# EAGLE design LTC3109 (EAGLE 7.1.0)
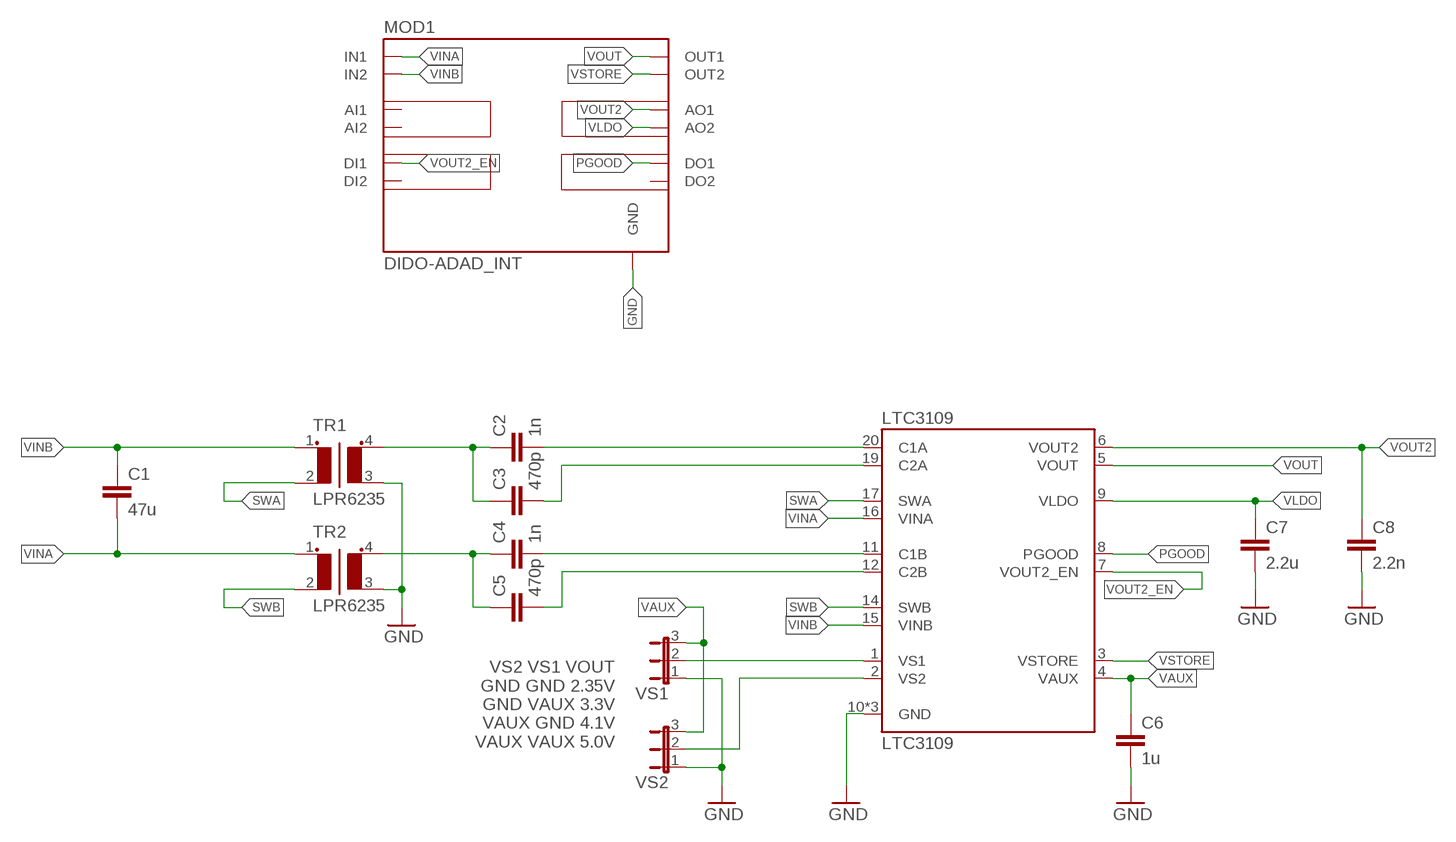
[diagram p0: schematic, sheet 1]

## Parts
C1  47u  C-EUC0805  [C0805]
C2  1n  C-EUC0805  [C0805]
C3  470p  C-EUC0805  [C0805]
C4  1n  C-EUC0805  [C0805]
C5  470p  C-EUC0805  [C0805]
C6  1u  C-EUC0805  [C0805]
C7  2.2u  C-EUC0805  [C0805]
C8  2.2n  C-EUC0805  [C0805]
LTC3109  LTC3109  [SSOP20_NARROW]
MOD1  DIDO-ADAD_INT  [DIDO-ADAD]
TR1  LPR6235  [LPR6235]
TR2  LPR6235  [LPR6235]
VS1  JP2E  [JP2]
VS2  JP2E  [JP2]

## Nets
GND: C6.2 C7.2 C8.2 LTC3109.10(GND) LTC3109.13(GND) LTC3109.18(GND) MOD1.GND1(GND) MOD1.GND2(GND) MOD1.GND3(GND) MOD1.GND4(GND) TR1.3(S2) TR2.3(S2) VS1.1 VS2.1
N$2: C2.2 LTC3109.20(C1A)
N$3: C3.2 LTC3109.19(C2A)
N$5: C2.1 C3.1 TR1.4(S1)
N$6: C4.2 LTC3109.11(C1B)
N$7: C5.2 LTC3109.12(C2B)
N$8: LTC3109.1(VS1) VS1.2
N$9: C4.1 C5.1 TR2.4(S1)
N$11: LTC3109.2(VS2) VS2.2
PGOOD: LTC3109.8(PGOOD) MOD1.DO1
SWA: LTC3109.17(SWA) TR1.2
SWB: LTC3109.14(SWB) TR2.2
VAUX: C6.1 LTC3109.4(VAUX) VS1.3 VS2.3
VINA: C1.2 LTC3109.16(VINA) MOD1.IN1_1(IN1) MOD1.IN1_2(IN1) MOD1.IN1_3(IN1) MOD1.IN1_4(IN1) TR2.1
VINB: C1.1 LTC3109.15(VINB) MOD1.IN2_1(IN2) MOD1.IN2_2(IN2) MOD1.IN2_3(IN2) MOD1.IN2_4(IN2) TR1.1
VLDO: C7.1 LTC3109.9(VLDO) MOD1.AO2
VOUT: LTC3109.5(VOUT) MOD1.OUT1_1(OUT1) MOD1.OUT1_2(OUT1) MOD1.OUT1_3(OUT1) MOD1.OUT1_4(OUT1)
VOUT2: C8.1 LTC3109.6(VOUT2) MOD1.AO1
VOUT2_EN: LTC3109.7(VOUT2_EN) MOD1.DI1
VSTORE: LTC3109.3(VSTORE) MOD1.OUT2_1(OUT2) MOD1.OUT2_2(OUT2) MOD1.OUT2_3(OUT2) MOD1.OUT2_4(OUT2)
Unconnected: MOD1.AI1 MOD1.AI2 MOD1.DI2 MOD1.DO2

## Notes on the sheet
- VS2 VS1 VOUT
  GND GND 2.35V
  GND VAUX 3.3V
  VAUX GND 4.1V
  VAUX VAUX 5.0V

## Library data of the parts
C1-C8 = rcl:C-EU: CAPACITOR, European symbol
LTC3109 = LTC3109:LTC3109
MOD1 = AllModules:DIDO-ADAD_INT
TR1 TR2 = LPR6235:LPR6235: TRANSFORMER for energy harvesting with a TEG and LTC3109 Source: Data sheet <http://datasheet.octopart.com/LPR6235-752SMLB-Coilcraft-datasheet-10791524.pdf> www.coilcraft.com
VS1 VS2 = Jumper_mod:JP2E: JUMPER

## Board
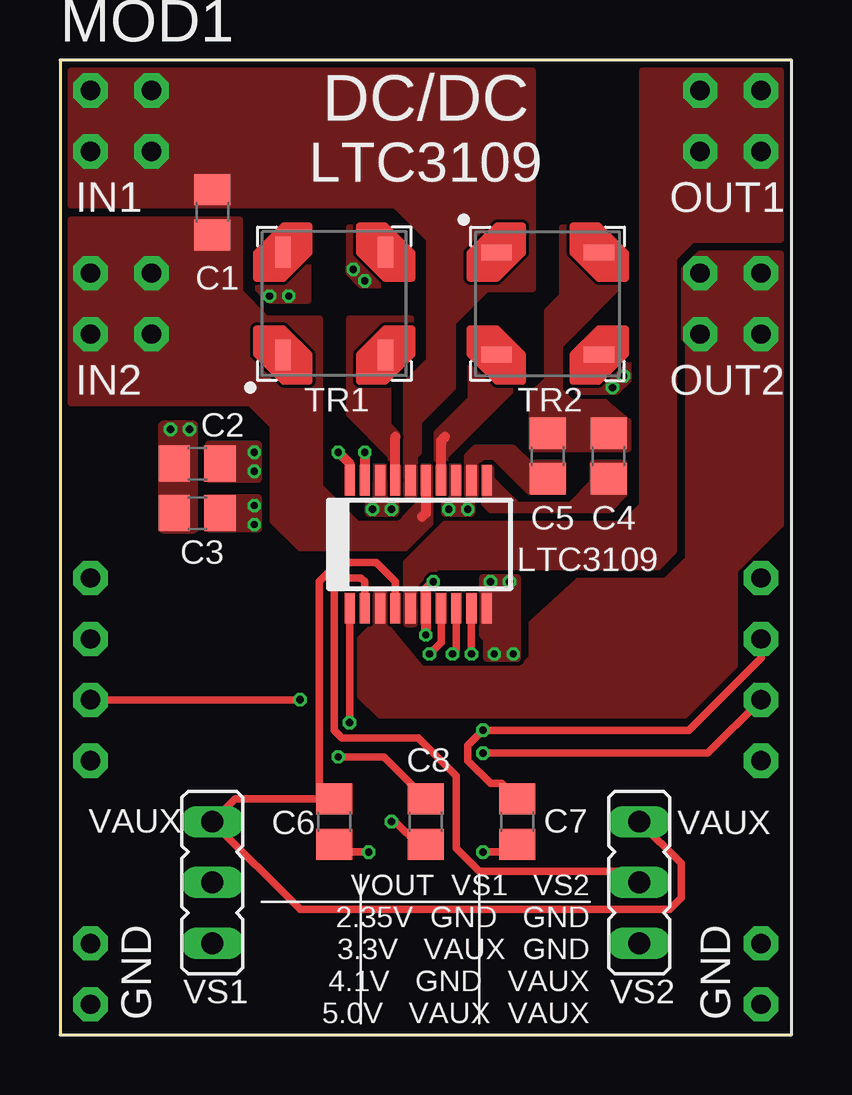
[diagram p1: board, top side]
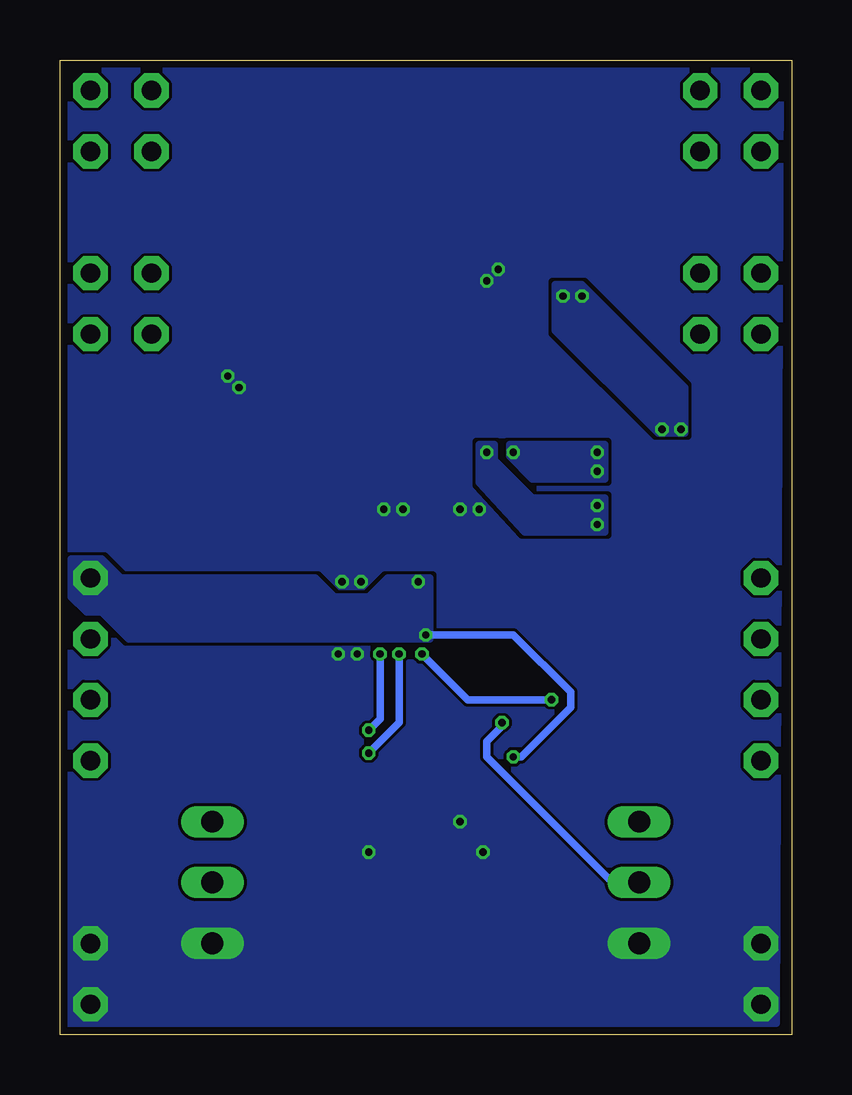
[diagram p2: board, bottom side, seen from below]

Size 30.48 x 40.64 mm. Coordinates in mm from the lower left corner, seen from the top.
Outline: 0,0 30.48,0 30.48,40.64 0,40.64 0,0
Copper layers (1*16): Top 0.035mm / dielectric 1.5mm / Bottom 0.035mm
Design rules "PCB-POOL HighSpec": minimum track width 0.125mm, minimum drill 0.2mm, track to track 0.125mm, track to pad 0.125mm, pad to pad 0.125mm, via to via 0.125mm, smd to smd 0.125mm, copper to edge 0.3mm, drill to drill 0.2mm, minimum pad ring 0.2mm, minimum via ring 0.125mm, stop-mask expansion 0.075mm, vias tented up to drill 0mil, thermal gap 0.2mm

### Footprints (pad centres in the part's own frame; a part is rotated, then mirrored left to right if it is on the bottom)
C0805 = smd 1.3 x 1.5: 1 -0.95,0; 2 0.95,0
SSOP20_NARROW = smd 0.419 x 1.27: 1 -3.175,-2.54; 2 -2.54,-2.54; 3 -1.905,-2.54; 4 -1.27,-2.54; 5 -0.635,-2.54; 6 0,-2.54; 7 0.635,-2.54; 8 1.27,-2.54; 9 1.905,-2.54; 10 2.54,-2.54; 11 2.54,2.794; 12 1.905,2.794; 13 1.27,2.794; 14 0.635,2.794; 15 0,2.794; 16 -0.635,2.794; 17 -1.27,2.794; 18 -1.905,2.794; 19 -2.54,2.794; 20 -3.175,2.794
DIDO-ADAD = drill 0.8 pad 1.422 octagon: AI1 0,-20.32; AI2 0,-22.86; AO1 27.94,-20.32; AO2 27.94,-22.86; DI1 0,-25.4; DI2 0,-27.94; DO1 27.94,-25.4; DO2 27.94,-27.94; GND1 0,-38.1; GND2 0,-35.56; GND3 27.94,-35.56; GND4 27.94,-38.1; IN1_1 0,0; IN1_2 0,-2.54; IN1_3 2.54,0; IN1_4 2.54,-2.54; IN2_1 0,-7.62; IN2_2 0,-10.16; IN2_3 2.54,-7.62; IN2_4 2.54,-10.16; OUT1_1 25.4,0; OUT1_2 25.4,-2.54; OUT1_3 27.94,0; OUT1_4 27.94,-2.54; OUT2_1 25.4,-7.62; OUT2_2 25.4,-10.16; OUT2_3 27.94,-7.62; OUT2_4 27.94,-10.16
LPR6235 = smd 1.27 x 0.635: 1 -2.13,2.135; 2 -2.13,-2.135; 3 2.13,-2.135; 4 2.13,2.135
JP2 = drill 0.914 long: 1 -2.54,0; 2 0,0; 3 2.54,0

### Placement (x,y rotation side)
C1  6.35,34.29 90 top
C2  5.71,23.81 0 top
C3  5.71,21.75 0 top
C4  22.86,24.13 270 top
C5  20.32,24.13 270 top
C6  11.43,8.89 270 top
C7  19.05,8.89 270 top
C8  15.24,8.89 270 top
LTC3109  15.24,20.32 0 top
MOD1  1.27,39.37 0 top
TR1  11.43,30.48 90 top
TR2  20.32,30.48 0 top
VS1  6.35,6.35 90 top
VS2  24.13,6.35 90 top

### Tracks (layer width: path | path; a pad name or v marks a point on that pad's centre or on a via)
GND  (via drill 0.3)
  Top 0.305: C6.2 11.75,7.62 v12.86,7.62 | v13.81,8.89 13.97,8.89 14.92,7.94 C8.2 | C7.2 18.73,7.62 v17.62,7.62
  other vias: 17.94,18.89 18.1,15.88 18.73,18.89 18.89,15.88 16.99,21.91 16.19,21.91 13.81,21.91 13.02,21.91 23.5,27.46 23.02,26.99 12.7,31.43 12.22,31.91
  pour Bottom (rank 2, no thermals): 0.48,40.16 0.64,0.48 30.16,0.48 30,40.16
  pour Top (no thermals): 17.62,19.05 17.62,16.67 17.78,16.51 17.78,15.72 19.05,15.72 19.05,19.05
  pour Top (rank 2, no thermals): 17.14,21.75 17.14,23.65 16.03,23.65 16.03,21.75
  pour Top (no thermals): 13.97,21.75 13.97,23.65 12.86,23.65 12.86,21.75
  pour Top (no thermals): 21.27,28.26 22.54,29.53 23.65,29.53 23.65,27.3 23.18,26.83 21.59,26.83 21.27,27.15
  pour Top (no thermals): 12.06,33.66 13.49,33.66 14.61,32.54 14.61,31.59 14.29,31.27 12.54,31.27 12.06,31.75
N$2  (via drill 0.3)
  Top 0.406: v11.59,24.29 12.06,23.81 LTC3109.20
  other vias: 8.1,24.29 8.1,23.5
  pour Bottom: 7.78,24.61 7.78,23.18 10.79,23.18 11.75,24.13 11.75,24.61
  pour Top (no thermals): 8.26,24.61 6.19,24.61 6.19,23.18 8.26,23.18
N$3  (via drill 0.3)
  Top 0.406: v12.7,24.29 LTC3109.19
  other vias: 8.1,21.27 8.1,22.07
  pour Bottom: 7.78,22.38 7.78,20.96 11.11,20.96 13.02,23.02 13.02,24.61 12.38,24.61 12.38,23.97 10.79,22.38
  pour Top (no thermals): 8.26,22.38 6.19,22.38 6.19,21.11 8.26,21.11
N$5  (via drill 0.3)
  other vias: 8.73,30.8 9.53,30.8 5.4,25.24 4.6,25.24
  pour Top (no thermals): 8.26,32.54 8.26,31.12 8.73,30.64 10.32,30.64 10.32,33.66 9.37,33.66
  pour Bottom (no thermals): 9.84,31.27 8.73,31.27 4.45,26.99 4.45,25.08 5.56,25.08 9.84,29.37
  pour Top (no thermals): 4.29,25.4 4.29,21.11 5.56,21.11 5.56,25.4
N$6
  pour Top (rank 2, no thermals): 17.62,23.65 17.62,22.38 17.62,22.23 17.94,21.91 22.86,21.91 23.5,22.54 23.5,23.81 22.23,23.81 22.23,23.02 21.27,22.07 19.05,22.07 18.41,22.7 17.94,23.18 17.94,23.65
N$7
  pour Top (no thermals): 20.95,22.7 19.53,22.7 18.1,24.13 17.62,24.13 17.3,23.81 17.3,22.54 16.99,22.54 16.99,24.13 17.3,24.45 18.89,24.45 19.53,23.81 20.95,23.81
N$8  (via drill 0.3)
  Top 0.305: LTC3109.1 v12.06,13.02
  Bottom 0.305: v12.06,13.02 12.06,12.86 12.7,12.22 12.7,11.59 7.46,6.35 VS1.2
N$9
  pour Top (rank 2, no thermals): 20.95,33.66 20.95,30.8 20.32,30.16 20.32,27.3 19.68,26.67 19.68,24.45 23.65,24.45 23.65,25.56 22.7,26.35 21.27,26.35 20.8,26.83 20.8,28.73 23.5,31.43 23.5,33.66
N$11
  Top 0.305: LTC3109.2 12.7,18.89 12.54,19.05 11.91,19.05 11.43,18.57 11.43,12.7 11.75,12.38 14.92,12.38 16.51,10.8 16.51,7.78 17.46,6.83 23.65,6.83 VS2.2
PGOOD  (via drill 0.3)
  Top 0.305: LTC3109.8 16.51,16.03 v16.35,15.88 | MOD1.DO1 26.99,11.75 v17.62,11.75
  Bottom 0.305: v16.35,15.88 16.35,13.02 v17.62,11.75
SWA
  Top 0.406: TR1.2 13.97,27.95 | LTC3109.17 13.97,24.92
  pour Top (rank 2, no thermals): 12.06,29.84 12.06,25.88 13.81,24.13 13.81,22.54 14.13,22.54 14.13,24.92 13.65,25.4 13.65,27.46 14.61,28.42 14.61,29.84
SWB
  Top 0.406: LTC3109.14 15.88,24.77 16.03,24.92
  pour Top (rank 3, no thermals): 15.72,22.38 15.72,25.08 17.14,26.51 17.14,29.37 19.68,29.37 19.68,27.78 16.03,24.13 16.03,22.38
VAUX
  Top 0.305: LTC3109.4 13.97,18.89 13.18,19.69 11.59,19.69 10.79,18.89 10.79,9.84 C6.1 7.3,9.84 VS1.3 10,5.24 25.4,5.24 25.88,5.72 25.88,7.14 VS2.3
VINA
  pour Top (no thermals): 0.48,40.16 0.48,34.61 12.7,34.61 13.97,34.61 15.24,33.34 15.4,33.18 15.4,31.12 19.68,31.12 19.68,40.16
  pour Top (no thermals): 15.4,31.43 15.4,28.1 14.45,27.15 14.45,22.54 14.76,22.54 14.76,24.13 14.92,24.29 14.92,25.56 16.35,26.99 16.35,29.69 18.1,31.43
VINB
  Top 0.406: LTC3109.15 15.24,21.75 15.08,21.59
  pour Top (no thermals): 0.48,33.97 0.48,26.35 10.79,26.35 10.79,29.84 8.57,29.84 7.46,30.96 7.46,33.97
  pour Top (rank 2, no thermals): 7.62,26.67 8.89,25.4 8.89,21.43 10,20.32 15.4,20.32 15.4,23.65 15.08,23.65 15.08,22.23 14.13,21.27 12.38,21.27 10.79,22.86 10.79,26.67
VLDO  (via drill 0.3)
  Top 0.305: LTC3109.9 v17.14,15.88 | C7.1 18.41,10.48 17.94,10.48 16.99,11.43 16.99,12.07 v17.62,12.7 26.19,12.7 29.21,15.72 MOD1.AO2
  Bottom 0.305: v17.62,12.7 17.14,13.18 v17.14,15.88
VOUT
  pour Top (no thermals): 14.45,17.14 14.45,19.69 16.03,21.27 23.5,21.27 24.29,22.07 24.29,40.16 30,40.16 30,33.18 26.35,33.18 25.56,32.38 25.56,20.16 24.92,19.53 15.72,19.53 14.76,18.57 14.76,17.14
VOUT2  (via drill 0.3)
  Top 0.305: C8.1 13.49,11.59 v11.59,11.59
  Top 0.406: v15.56,18.89 15.24,18.57 LTC3109.6 v15.24,16.67
  Bottom 0.305: v15.24,16.67 11.59,16.67 9.21,14.29 9.21,13.65 11.27,11.59 v11.59,11.59
  pour Bottom (no thermals): 15.08,16.51 15.08,19.05 16.83,19.05 17.62,18.26 19.05,18.26 19.84,19.05 27.94,19.05 28.73,19.84 30,19.84 30,18.26 29.37,17.62 28.73,17.62 27.62,16.51
VOUT2_EN  (via drill 0.3)
  Top 0.305: LTC3109.7 15.88,16.35 v15.4,15.88 | v10,13.97 MOD1.DI1
  Bottom 0.305: v15.4,15.88 13.49,13.97 v10,13.97
VSTORE
  pour Top (rank 2, no thermals): 13.18,18.41 13.18,17.14 12.54,16.51 12.54,14.13 13.34,13.34 26.04,13.34 28.1,15.4 28.1,19.37 30,21.27 30,32.54 26.67,32.54 26.04,31.91 26.04,29.05 26.19,28.89 26.19,19.84 25.24,18.89 21.59,18.89 19.68,17.14 19.68,15.72 19.21,15.24 15.08,15.24 13.49,17.14 13.49,18.41

### Text on the board
tNames: DC/DC | LTC3109 | VAUX | VAUX | VOUT VS1 VS2 / 2.35V GND GND / 3.3V VAUX GND / 4.1V GND VAUX / 5.0V VAUX VAUX
bStop: Beckedahl & Kokert / 12.05.2015